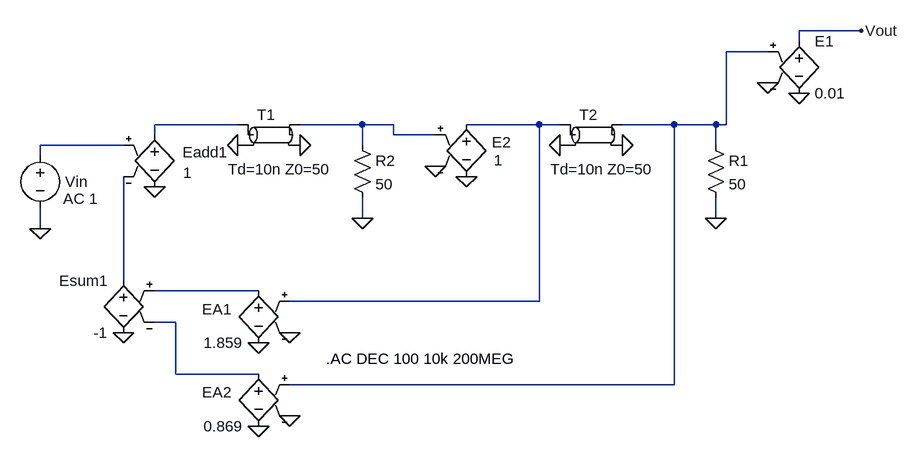
[diagram p0: schematic _Fig4_51_MSD.asc]
_Fig4_51_MSD.asc, the LTspice schematic file:
Version 4
SHEET 1 2740 696
WIRE 1776 -880 1680 -880
WIRE 1680 -864 1680 -880
WIRE 1632 -848 1568 -848
WIRE 816 -736 688 -736
WIRE 1008 -736 912 -736
WIRE 1056 -736 1008 -736
WIRE 1280 -736 1168 -736
WIRE 1312 -736 1280 -736
WIRE 1488 -736 1408 -736
WIRE 1552 -736 1488 -736
WIRE 1568 -736 1568 -848
WIRE 1568 -736 1552 -736
WIRE 688 -720 688 -736
WIRE 1056 -720 1056 -736
WIRE 1120 -720 1056 -720
WIRE 640 -704 512 -704
WIRE 1008 -704 1008 -736
WIRE 1552 -704 1552 -736
WIRE 512 -688 512 -704
WIRE 1008 -592 1008 -624
WIRE 1552 -592 1552 -624
WIRE 512 -576 512 -608
WIRE 640 -496 640 -656
WIRE 848 -480 688 -480
WIRE 1280 -464 1280 -736
WIRE 1280 -464 896 -464
WIRE 720 -432 688 -432
WIRE 720 -352 720 -432
WIRE 848 -352 720 -352
WIRE 1488 -336 1488 -736
WIRE 1488 -336 896 -336
FLAG 912 -704 0
FLAG 816 -704 0
FLAG 688 -640 0
FLAG 512 -576 0
FLAG 1776 -880 Vout
FLAG 1552 -592 0
FLAG 1408 -704 0
FLAG 1312 -704 0
FLAG 640 -416 0
FLAG 848 -400 0
FLAG 896 -416 0
FLAG 848 -272 0
FLAG 896 -288 0
FLAG 1632 -800 0
FLAG 1680 -784 0
FLAG 1008 -592 0
FLAG 1168 -656 0
FLAG 1120 -672 0
SYMBOL tline 864 -720 R0
WINDOW 0 -18 -31 Left 0
WINDOW 3 -63 53 Left 0
SYMATTR InstName T1
SYMATTR Value Td=10n Z0=50
SYMBOL e 688 -736 R0
WINDOW 0 43 43 Left 0
WINDOW 3 44 74 Left 0
SYMATTR InstName Eadd1
SYMATTR Value 1
SYMBOL voltage 512 -704 R0
WINDOW 0 38 56 Left 0
WINDOW 123 35 82 Left 0
WINDOW 39 0 0 Left 0
SYMATTR InstName Vin
SYMATTR Value2 AC 1
SYMATTR Value ""
SYMBOL res 1536 -720 R0
SYMATTR InstName R1
SYMATTR Value 50
SYMBOL tline 1360 -720 R0
WINDOW 0 -18 -31 Left 0
WINDOW 3 -63 53 Left 0
SYMATTR InstName T2
SYMATTR Value Td=10n Z0=50
SYMBOL e 640 -512 M0
SYMATTR InstName Esum1
SYMATTR Value -1
SYMBOL e 848 -496 M0
WINDOW 0 42 44 Left 0
SYMATTR InstName EA1
SYMATTR Value 1.859
SYMBOL e 848 -368 M0
WINDOW 0 42 44 Left 0
SYMATTR InstName EA2
SYMATTR Value 0.869
SYMBOL e 1680 -880 R0
SYMATTR InstName E1
SYMATTR Value 0.01
SYMBOL res 992 -720 R0
SYMATTR InstName R2
SYMATTR Value 50
SYMBOL e 1168 -752 R0
WINDOW 0 39 43 Left 0
WINDOW 3 42 71 Left 0
SYMATTR InstName E2
SYMATTR Value 1
TEXT 952 -376 Left 0 !.AC DEC 100 10k 200MEG

The netlist it stands for:
* _Fig4_51_MSD.asc
T1 N002 0 N003 0 Td=10n Z0=50
Eadd1 N002 0 N005 N006 1
Vin N005 0 AC 1
R1 N001 0 50
T2 N004 0 N001 0 Td=10n Z0=50
Esum1 N006 0 N007 N008 -1
EA1 N007 0 N004 0 1.859
EA2 N008 0 N001 0 0.869
E1 Vout 0 N001 0 0.01
R2 N003 0 50
E2 N004 0 N003 0 1
.AC DEC 100 10k 200MEG
.backanno
.end